# EAGLE design SparkFun_Lipo_Fuel_Gauge (EAGLE 9.6.2)
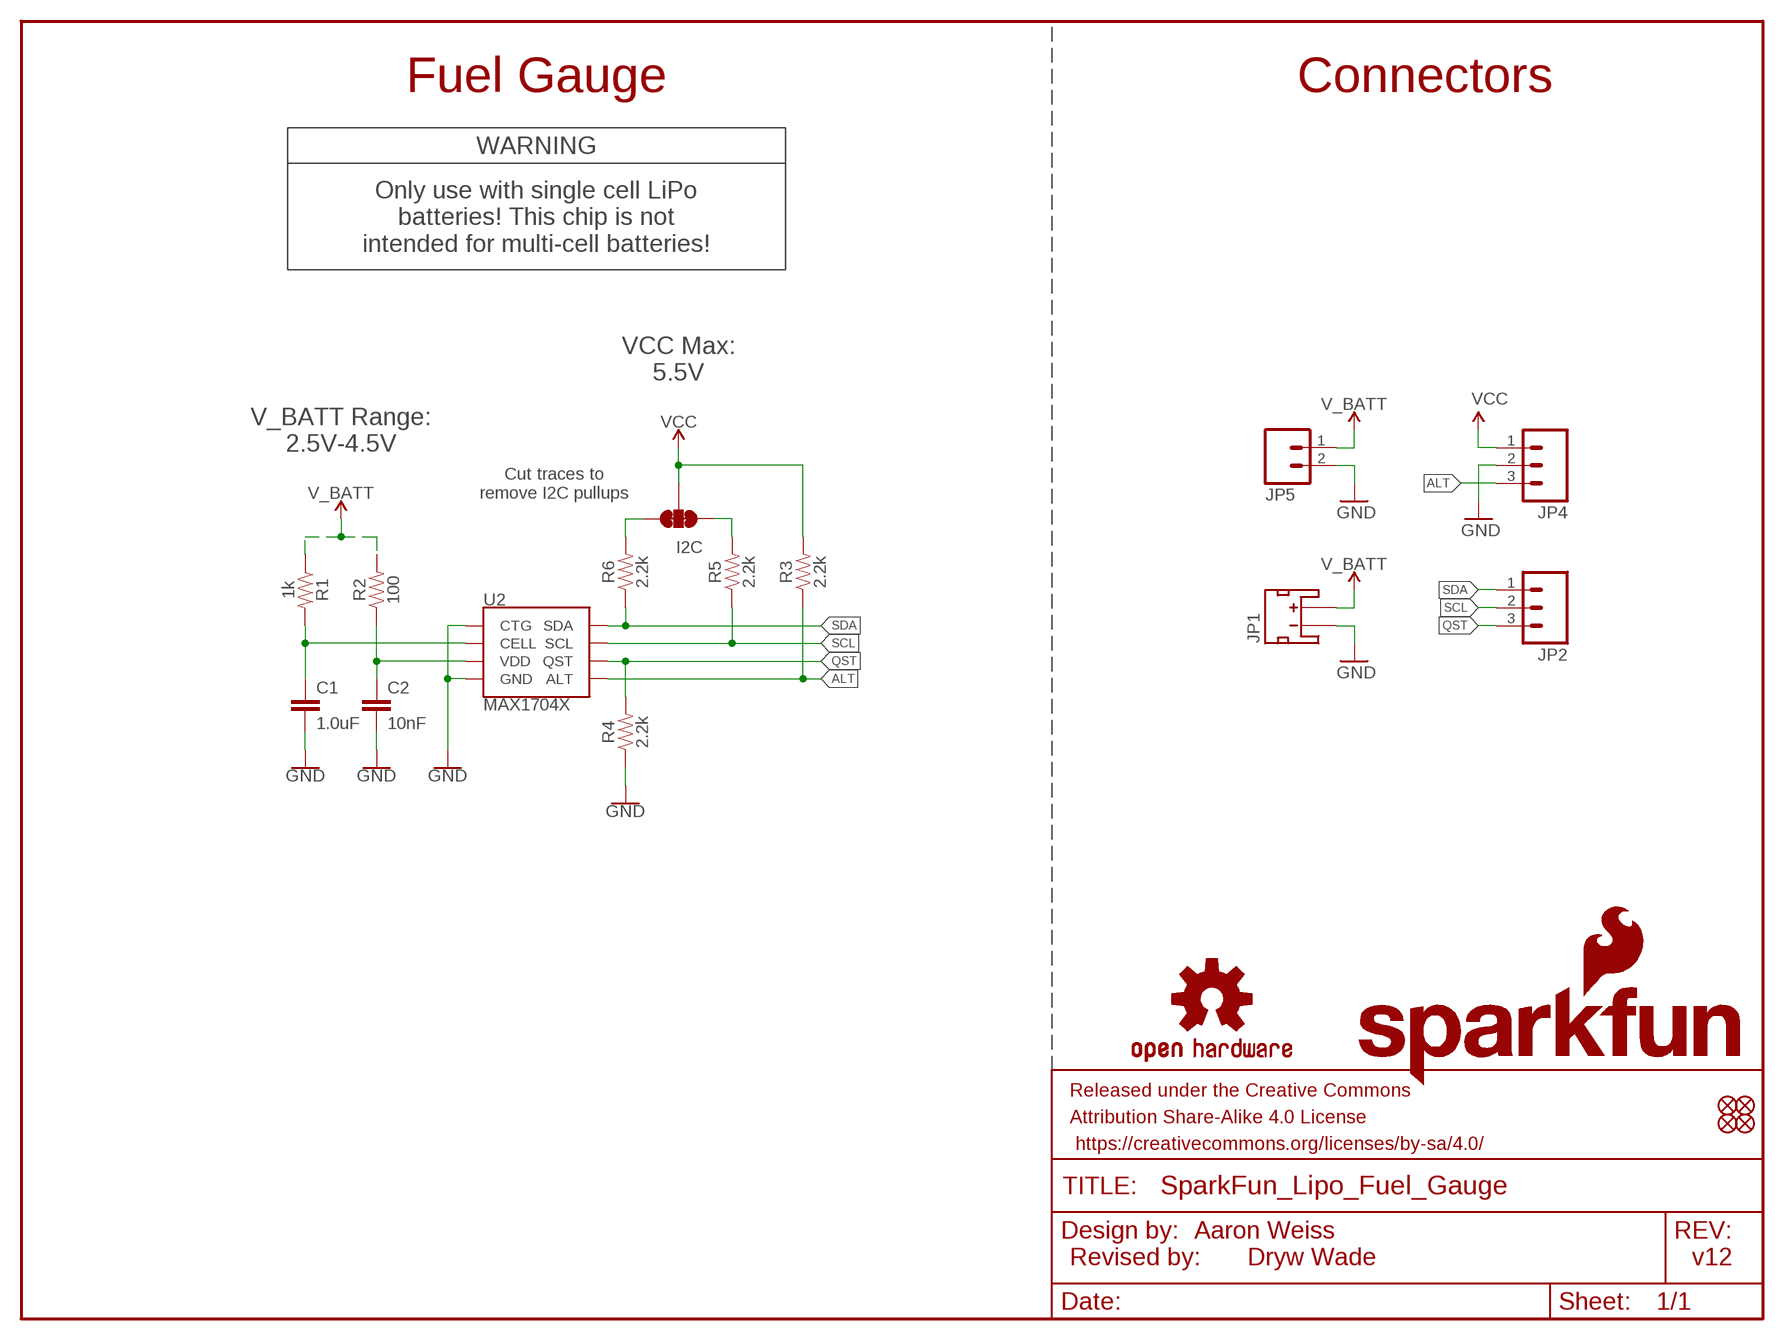
[diagram p0: schematic, sheet 1]

## Parts
C1  1.0uF  1.0UF-0402T-16V-10%  [0402-TIGHT]
C2  10nF  10NF-0402T-25V-10%  [0402-TIGHT]
FRAME1  FRAME-LETTER  [CREATIVE_COMMONS]
I2C  JUMPER-SMT_3_2-NC_TRACE_SILK  [SMT-JUMPER_3_2-NC_TRACE_SILK]
JP1  input  JST_2MM_MALE  [JST-2-SMD]
JP2  CONN_031X03_NO_SILK  [1X03_NO_SILK]
JP3  SFE_LOGO_FLAME.1_INCH  [SFE_LOGO_FLAME_.1]
JP4  CONN_031X03_NO_SILK  [1X03_NO_SILK]
JP5  CONN_021X02_NO_SILK  [1X02_NO_SILK]
JP6  FIDUCIALUFIDUCIAL  [FIDUCIAL-MICRO]
JP7  FIDUCIALUFIDUCIAL  [FIDUCIAL-MICRO]
JP8  FIDUCIALUFIDUCIAL  [FIDUCIAL-MICRO]
JP9  FIDUCIALUFIDUCIAL  [FIDUCIAL-MICRO]
LOGO1  SFE_LOGO_NAME_FLAMEBLANK  [BLANK]
R1  1k  1KOHM-0402T-1/16W-1%  [0402-TIGHT]
R2  100  100OHM-0402-TIGHT-1/16W-1%  [0402-TIGHT]
R3  2.2k  2.2KOHM-0402T-1/16W-1%  [0402-TIGHT]
R4  2.2k  2.2KOHM-0402T-1/16W-1%  [0402-TIGHT]
R5  2.2k  2.2KOHM-0402T-1/16W-1%  [0402-TIGHT]
R6  2.2k  2.2KOHM-0402T-1/16W-1%  [0402-TIGHT]
U2  MAX1704X  [TDFN-8]
U$1  OSHW-LOGOS  [OSHW-LOGO-S]

## Nets
ALT: JP4.3 R3.1 U2.5(ALT)
GND: C1.2 C2.2 JP1.1(-) JP4.2 JP5.2 R4.1 U2.1(CTG) U2.4(GND) U2.EP(GND)
N$1: I2C.3 R6.2
N$2: C1.1 R1.2 U2.2(CELL)
N$3: I2C.1 R5.2
QST: JP2.3 R4.2 U2.6(QST)
SCL: JP2.2 R5.1 U2.7(SCL)
SDA: JP2.1 R6.1 U2.8(SDA)
V_BATT: JP1.2(+) JP5.1 R1.1 R2.2
VCC: I2C.2 JP4.1 R3.2
VDD: C2.1 R2.1 U2.3(VDD)
Unconnected: JP1.NC1(PAD1) JP1.NC2(PAD2)

## Notes on the sheet
- Fuel Gauge | Connectors
- WARNING
- Only use with single cell LiPo
  batteries! This chip is not
  intended for multi-cell batteries!
- VCC Max:
  5.5V
- V_BATT Range:
  2.5V-4.5V
- Cut traces to
  remove I2C pullups
- Aaron Weiss
- Revised by: | Dryw Wade | v12

## Library data of the parts
C1 = SparkFun-Capacitors:1.0UF: 1µF ceramic capacitors A capacitor is a passive two-terminal electrical component used to store electrical energy temporarily in an electric field.; PROD_ID: CAP-12417
C2 = SparkFun-Capacitors:10NF: 0.01uF/10nF/10,000pF ceramic capacitors A capacitor is a passive two-terminal electrical component used to store electrical energy temporarily in an electric field. CAP-09321; PROD_ID: CAP-14847
FRAME1 = SparkFun-Aesthetics:FRAME-LETTER: Schematic Frame - Letter Standard 8.5x11 US Letter frame
I2C = SparkFun-Jumpers:JUMPER-SMT_3_2-NC_TRACE: Normally closed trace jumper (2 of 2 connections) This jumper has a trace between all three pads so they are normally closed (NC). Use a razor knife to open the connection(s). For best results follow the IPC guidelines for cutting traces: Cutout at least 0.063 mm (0.005 in). Remove all loose material to clean up the cut area. Seal the cut with an approved epoxy. Reapply solder to reclose the connection(s).
JP1 = SparkFun-Connectors:JST_2MM_MALE: JST 2MM MALE RA CONNECTOR Two pin, compact surface mount connector. Commonly used as a battery input connection point. We really like the solid locking feeling and high current rating on these small connectors. We use these all the time as battery connectors. Mates to single-cell LiPo batteries. Here is the connector we sell at SparkFun: JST Right Angle Connector - White <https://www.sparkfun.com/products/8612> (PRT-08612) Datasheet <http://www.sparkfun.com/datasheets/Prototyping/Connectors/JST-Horizontal.pdf> It was used on these SparkFun products: SparkFun MOSFET Power Controller <https://www.sparkfun.com/products/11214> (PRT-11214) SparkFun Battery Babysitter - LiPo Battery Manager <https://www.sparkfun.com/products/13777> (PRT-13777) And many, many others that required a lipo battery connection.; PROD_ID: CONN-11443; SF_ID: PRT-08612
JP2 JP4 = SparkFun-Connectors:CONN_03: Multi connection point. Often used as Generic Header-pin footprint for 0.1 inch spaced/style header connections On any of the 0.1 inch spaced packages, you can populate with these: Break Away Headers - Straight <https://www.sparkfun.com/products/116> (PRT-00116) Break Away Male Headers - Right Angle <https://www.sparkfun.com/products/553> (PRT-00553) Female Headers <https://www.sparkfun.com/products/115> (PRT-00115) Break Away Headers - Machine Pin <https://www.sparkfun.com/products/117> (PRT-00117) Break Away Female Headers - Swiss Machine Pin <https://www.sparkfun.com/products/743> (PRT-00743) Stackable Header - 3 Pin (Female, 0.1") <https://www.sparkfun.com/products/13875> (PRT-13875) For SCREWTERMINALS and SPRING TERMINALS visit here: Screw Terimnals on SparkFun.com <https://www.sparkfun.com/search/results?term=Screw+Terminals> (5mm/3.5mm/2.54mm spacing) This device is also useful as a general connection point to wire up your design to another part of your project. Our various solder wires solder well into these plated through hole pads. Hook-Up Wire - Assortment (Stranded, 22 AWG) <https://www.sparkfun.com/products/11375> (PRT-11375) Hook-Up Wire - Assortment (Solid Core, 22 AWG) <https://www.sparkfun.com/products/11367> (PRT-11367) View the entire wire category on our website here <https://www.sparkfun.com/categories/141> Special notes: Molex polarized connector foot print use with SKU : PRT-08232 with associated crimp pins and housings.
JP3 = SparkFun-Aesthetics:SFE_LOGO_FLAME: SparkFun Flame Logo This is the SparkFun flame logo. The logo on the schematic will always be the same size; the package variant is the height of the flame. Default layer for the logo on the board is tSilk.
JP5 = SparkFun-Connectors:CONN_02: Multi connection point. Often used as Generic Header-pin footprint for 0.1 inch spaced/style header connections On any of the 0.1 inch spaced packages, you can populate with these: Break Away Headers - Straight <https://www.sparkfun.com/products/116> (PRT-00116) Break Away Male Headers - Right Angle <https://www.sparkfun.com/products/553> (PRT-00553) Female Headers <https://www.sparkfun.com/products/115> (PRT-00115) Break Away Headers - Machine Pin <https://www.sparkfun.com/products/117> (PRT-00117) Break Away Female Headers - Swiss Machine Pin <https://www.sparkfun.com/products/743> (PRT-00743) For SCREWTERMINALS and SPRING TERMINALS visit here: Screw Terimnals on SparkFun.com <https://www.sparkfun.com/search/results?term=Screw+Terminals> (5mm/3.5mm/2.54mm spacing) This device is also useful as a general connection point to wire up your design to another part of your project. Our various solder wires solder well into these plated through hole pads. Hook-Up Wire - Assortment (Stranded, 22 AWG) <https://www.sparkfun.com/products/11375> (PRT-11375) Hook-Up Wire - Assortment (Solid Core, 22 AWG) <https://www.sparkfun.com/products/11367> (PRT-11367) View the entire wire category on our website here <https://www.sparkfun.com/categories/141> Special notes: Molex polarized connector foot print use with: PRT-08233 with associated crimp pins and housings. 2.54_SCREWTERM for use with PRT-10571. 3.5mm Screw Terminal footprints for PRT-08084 5mm Screw Terminal footprints for use with PRT-08432
JP6-JP9 = SparkFun-Aesthetics:FIDUCIAL: Fiducial Alignment Points Point-of-reference for pick-and-place machines and other optical instruments.
LOGO1 = SparkFun-Aesthetics:SFE_LOGO_NAME_FLAME: SparkFun Font Logo w/ Flame This is the SparkFun full logo. The logo on the schematic will always be the same size; the package variant is the height of the flame part of the logo. Default layer for the logo on the board is tSilk.
R1 = SparkFun-Resistors:1KOHM: 1kΩ resistor A resistor is a passive two-terminal electrical component that implements electrical resistance as a circuit element. Resistors act to reduce current flow, and, at the same time, act to lower voltage levels within circuits. - Wikipedia; PROD_ID: RES-14342
R2 = SparkFun-Resistors:100OHM: 100Ω resistor A resistor is a passive two-terminal electrical component that implements electrical resistance as a circuit element. Resistors act to reduce current flow, and, at the same time, act to lower voltage levels within circuits. - Wikipedia; PROD_ID: RES-14962
R3-R6 = SparkFun-Resistors:2.2KOHM: 2.2kΩ resistor A resistor is a passive two-terminal electrical component that implements electrical resistance as a circuit element. Resistors act to reduce current flow, and, at the same time, act to lower voltage levels within circuits. - Wikipedia; PROD_ID: RES-14341
U2 = SparkFun-IC-Power:MAX1704X: MAX17043/MAX17044: Battery Fuel Guage (43 is 1cell, 44 is 2cell); PROD_ID: IC-10399
U$1 = SparkFun:OSHW-LOGO: Open Source Hardware Logo This logo indicates the piece of hardware it is found on incorporates a OSHW license and/or adheres to the definition of open source hardware found here: http://freedomdefined.org/OSHW

## Board
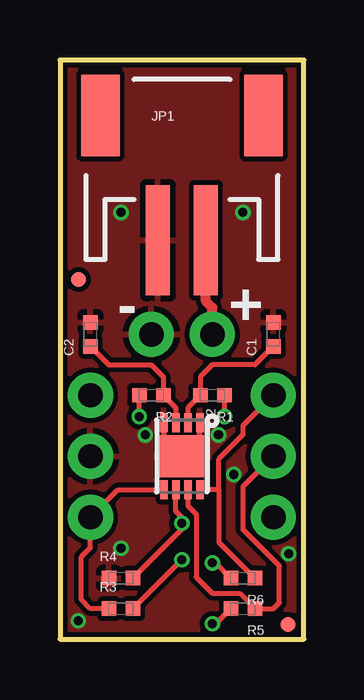
[diagram p1: board, top side]
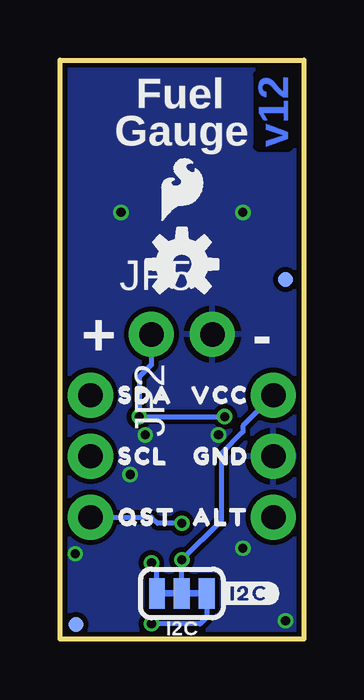
[diagram p2: board, bottom side, seen from below]

Size 10.16 x 24.13 mm. Coordinates in mm from the lower left corner, seen from the top.
Outline: 0,24.13 0,0 10.16,0 10.16,24.13 0,24.13
Copper layers (1*16): Top 0.035mm / dielectric 1.5mm / Bottom 0.035mm
Design rules "SparkFun-2-Layer-Minimum-JLCPCB": minimum track width 5mil, minimum drill 0.3mm, track to track 5mil, track to pad 5mil, pad to pad 5mil, via to via 5mil, smd to smd 5mil, copper to edge 7mil, drill to drill 7mil, minimum pad ring 5mil, minimum via ring 5mil, stop-mask expansion 2.5mil, vias tented up to drill 25mil, thermal gap 10mil

### Footprints (pad centres in the part's own frame; a part is rotated, then mirrored left to right if it is on the bottom)
0402-TIGHT = smd 0.6 x 0.6: 1 -0.5,0; 2 0.5,0
SMT-JUMPER_3_2-NC_TRACE_SILK = smd 0.66 x 1.27: 1 -1.041,0; 2 0,0; 3 1.041,0
JST-2-SMD = smd 1 x 4.6: 1 -1,-3.7; 2 1,-3.7 | smd 1.6 x 3.4: NC1 -3.4,1.5; NC2 3.4,1.5
1X03_NO_SILK = drill 1.016 pad 1.88: 1 0,0; 2 2.54,0; 3 5.08,0
1X02_NO_SILK = drill 1.016 pad 1.88: 1 0,0; 2 2.54,0
FIDUCIAL-MICRO = smd 0.635 x 0.635: 1 0,0
TDFN-8 = smd 0.8 x 0.3: 1 -1.4,0.75; 2 -1.4,0.25; 3 -1.4,-0.25; 4 -1.4,-0.75; 5 1.4,-0.75; 6 1.4,-0.25; 7 1.4,0.25; 8 1.4,0.75 | smd 1.73 x 1.88: EP 0,0

### Placement (x,y rotation side)
C1  8.89,12.7 90 top
C2  1.27,12.7 90 top
FRAME1  -27.94,-13.97 0 top  (outside the outline)
I2C  5.08,1.91 180 bottom
JP1  5.08,20.32 0 top
JP2  8.89,10.16 270 bottom
JP3  5.08,18.75 0 bottom
JP4  1.27,10.16 270 bottom
JP5  6.35,12.7 0 bottom
JP6  9.5,0.61 0 top
JP7  0.76,14.99 0 top
JP8  0.76,14.99 0 bottom
JP9  9.5,0.61 0 bottom
LOGO1  -7.62,-15.24 0 top  (outside the outline)
R1  6.35,10.16 180 top
R2  3.81,10.16 180 top
R3  2.54,1.27 0 top
R4  2.54,2.54 0 top
R5  7.62,1.27 180 top
R6  7.62,2.54 180 top
U2  5.08,7.62 270 top
U$1  5.08,15.62 0 bottom
U$2  [SDA0]  8.26,10.16 0 bottom
U$3  [SCL0]  8.26,7.62 0 bottom
U$4  [QST0]  8.26,5.08 0 bottom
U$5  [VCC0]  1.78,10.16 0 bottom
U$6  [GND0]  1.78,7.62 0 bottom
U$7  [ALT0]  1.78,5.08 0 bottom
U$8  [#I2C#0]  3.56,1.91 0 bottom

### Tracks (layer width: path | path; a pad name or v marks a point on that pad's centre or on a via)
ALT
  Top 0.203: U2.5 2.41,6.22 JP4.3 1.27,3.81 0.89,3.43 0.89,1.65 1.27,1.27 R3.1
GND  (via drill 0.38)
  Top 0.203: U2.1 5.83,8.27 5.84,8.26 5.21,7.62 | U2.4 4.33,8.37 U2.EP
  other vias: 2.54,17.78 2.54,3.78 7.62,17.78 7.24,6.86 3.56,8.51 6.6,8.51 0.76,0.76 9.53,3.56
  pour Bottom (isolate 0.203): 10.16,24.13 0,24.13 0,0 10.16,0
  pour Top (isolate 0.203): 10.16,24.13 0,24.13 0,0 10.16,0
N$1  (via drill 0.38)
  Top 0.203: R6.2 6.49,3.17 v6.35,3.17
  Bottom 0.203: I2C.3 6.12,2.95 v6.35,3.17
N$2
  Top 0.203: C1.1 8.12,11.43 6.35,11.43 5.85,10.93 R1.2 5.33,9.64 U2.2
N$3  (via drill 0.38)
  Top 0.203: R5.2 6.49,0.64 v6.35,0.64
  Bottom 0.203: I2C.1 4.04,0.91 4.32,0.64 v6.35,0.64
QST  (via drill 0.38)
  Top 0.203: R4.2 5.08,4.58 v5.08,4.83 5.08,5.08 4.83,5.33 U2.6
  Bottom 0.203: v5.08,4.83 6.1,4.83 6.35,5.08 JP2.3
SCL
  Top 0.203: JP2.2 7.62,6.35 7.62,4.57 9.14,3.05 9.14,1.52 8.89,1.27 R5.1 7.49,1.91 6.35,1.91 5.68,2.58 5.68,5.2 5.33,5.55 U2.7
SDA
  Top 0.203: 6.62,6.22 6.62,7.51 7.62,8.51 7.62,8.89 JP2.1 | 6.62,6.22 U2.8 | R6.1 6.62,4.04 6.62,6.22
V_BATT  (via drill 0.38)
  Top 0.203: v6.86,9.27 R1.1 | v3.3,9.27 R2.2
  Top 0.406: JP5.1 6.35,13.81 6.08,14.08 JP1.2
  Bottom 0.203: JP5.1 6.35,11.43 6.86,10.92 v6.86,9.27 v3.3,9.27
VCC  (via drill 0.38)
  Top 0.203: R3.2 v5.07,3.3 v5.08,3.3
  Bottom 0.203: JP4.1 2.54,8.89 2.54,8.64 3.43,7.75 3.43,4.95 v5.08,3.3 I2C.2
VDD
  Top 0.203: C2.1 2.04,11.43 3.81,11.43 4.31,10.93 R2.1 4.83,9.64 U2.3

### Text on the board
Bottom: v12
tPlace: - | +
bPlace: Fuel | Gauge | - | +
Measures: Units: inches
tDocu: Aaron Weiss | Revised by: | Dryw Wade